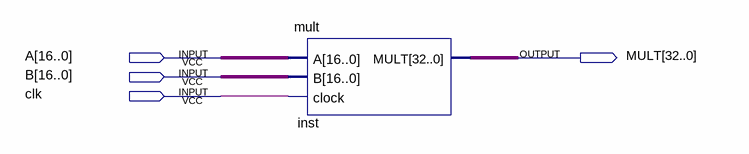
[diagram p0: schematic sheet]
// Quartus schematic test.bdf as structural Verilog: 1 symbols, 4 pins
module test (
  input  [16:0] A,
  input  [16:0] B,
  input  clk,
  output [32:0] MULT
);

  mult inst (.A(A), .B(B), .clock(clk), .MULT(MULT));
endmodule
